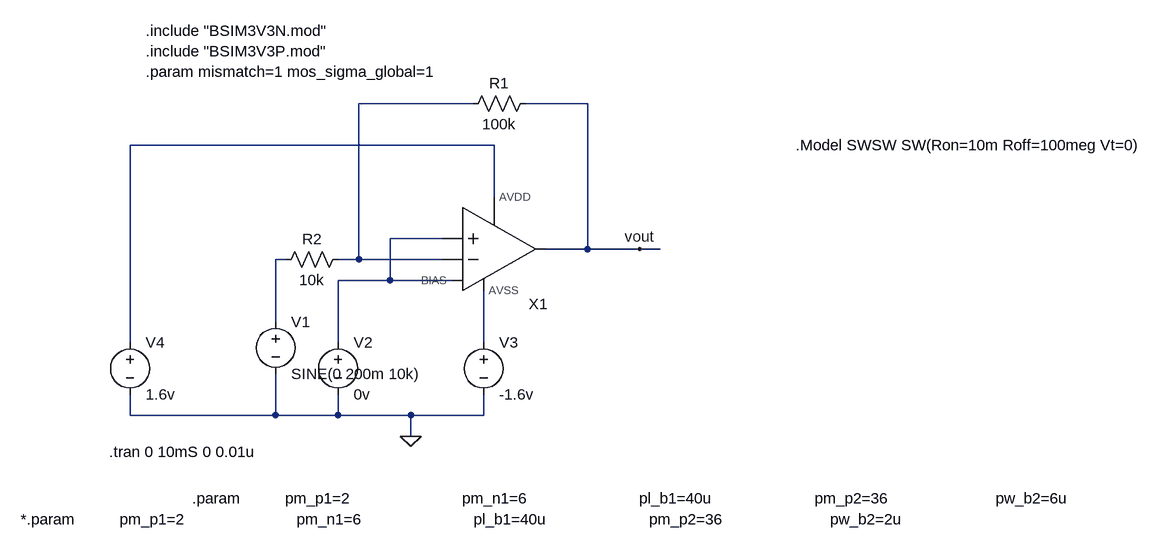
[diagram p0: schematic tb_comp_medium_trun.asc]
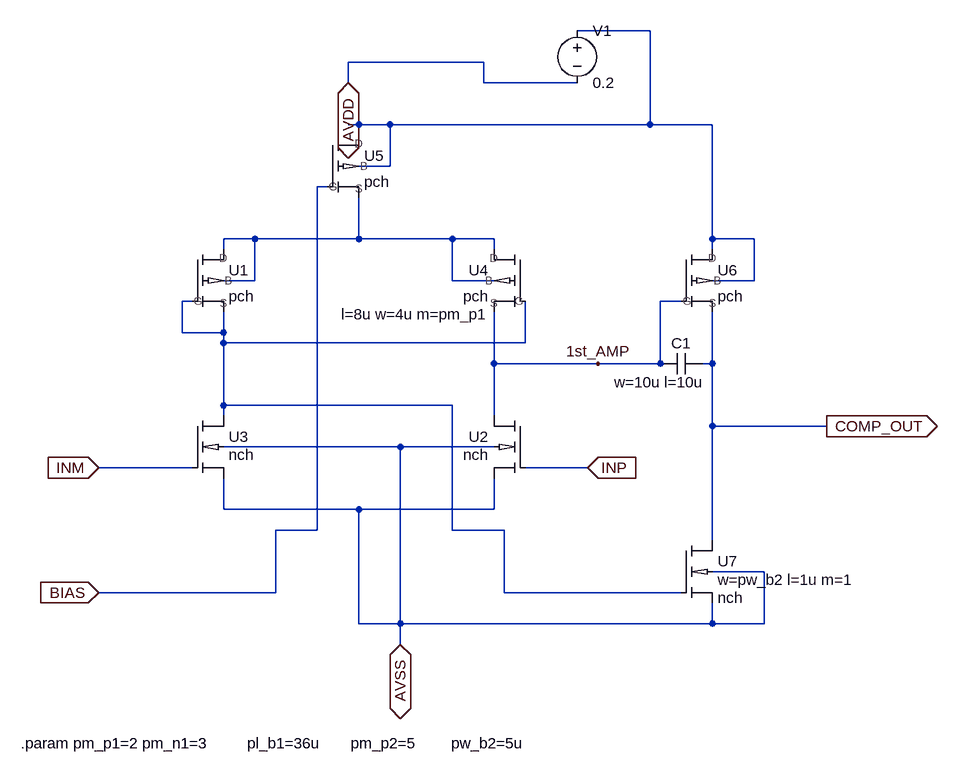
[diagram p1: sub-circuit comp_medium.asc]
tb_comp_medium_trun.asc, the LTspice schematic file:
Version 4
SHEET 1 1324 860
WIRE 192 -80 16 -80
WIRE 368 -80 272 -80
WIRE 224 -16 -336 -16
WIRE 224 64 224 -16
WIRE 144 128 64 128
WIRE 368 144 368 -80
WIRE 368 144 304 144
WIRE 448 144 368 144
WIRE 480 144 448 144
WIRE -96 160 -112 160
WIRE 16 160 16 -80
WIRE 16 160 -16 160
WIRE 144 160 16 160
WIRE 64 192 64 128
WIRE 64 192 -16 192
WIRE 160 192 64 192
WIRE -112 256 -112 160
WIRE -336 288 -336 -16
WIRE -16 288 -16 192
WIRE 208 288 208 208
WIRE -336 400 -336 368
WIRE -112 400 -112 336
WIRE -112 400 -336 400
WIRE -16 400 -16 368
WIRE -16 400 -112 400
WIRE 96 400 -16 400
WIRE 208 400 208 368
WIRE 208 400 96 400
WIRE 96 432 96 400
FLAG 96 432 0
FLAG 448 144 vout
SYMBOL comp_medium 208 144 R0
SYMATTR InstName X1
SYMBOL voltage -16 272 R0
WINDOW 123 0 0 Left 2
WINDOW 39 0 0 Left 2
SYMATTR InstName V2
SYMATTR Value 0v
SYMBOL voltage 208 272 R0
WINDOW 123 0 0 Left 2
WINDOW 39 0 0 Left 2
SYMATTR InstName V3
SYMATTR Value -1.6v
SYMBOL voltage -336 272 R0
WINDOW 123 0 0 Left 2
WINDOW 39 0 0 Left 2
SYMATTR InstName V4
SYMATTR Value 1.6v
SYMBOL voltage -112 240 R0
WINDOW 123 0 0 Left 2
WINDOW 39 0 0 Left 2
SYMATTR InstName V1
SYMATTR Value SINE(0 200m 10k)
SYMBOL res 176 -64 R270
WINDOW 0 32 56 VTop 2
WINDOW 3 0 56 VBottom 2
SYMATTR InstName R1
SYMATTR Value 100k
SYMBOL res -112 176 R270
WINDOW 0 32 56 VTop 2
WINDOW 3 0 56 VBottom 2
SYMATTR InstName R2
SYMATTR Value 10k
TEXT -368 456 Left 2 !.tran 0 10mS 0 0.01u
TEXT -504 560 Left 2 !*.param          pm_p1=2                         pm_n1=6                         pl_b1=40u                       pm_p2=36                        pw_b2=2u
TEXT 688 -16 Left 2 !.Model SWSW SW(Ron=10m Roff=100meg Vt=0)
TEXT -312 -192 Left 2 !.include "BSIM3V3N.mod"\n.include "BSIM3V3P.mod"\n.param mismatch=1 mos_sigma_global=1
TEXT -240 528 Left 2 !.param          pm_p1=2                         pm_n1=6                         pl_b1=40u                       pm_p2=36                        pw_b2=6u

comp_medium.asc, the sub-circuit schematic file:
Version 4
SHEET 1 3700 4048
WIRE 624 -256 512 -256
WIRE 368 -208 160 -208
WIRE 160 -176 160 -208
WIRE 368 -176 368 -208
WIRE 512 -176 368 -176
WIRE 176 -112 160 -112
WIRE 224 -112 176 -112
WIRE 624 -112 624 -256
WIRE 624 -112 224 -112
WIRE 720 -112 624 -112
WIRE 176 -96 176 -112
WIRE 224 -48 224 -112
WIRE 224 -48 176 -48
WIRE 128 -16 112 -16
WIRE 16 64 -32 64
WIRE 176 64 176 0
WIRE 176 64 16 64
WIRE 320 64 176 64
WIRE 384 64 320 64
WIRE 720 64 720 -112
WIRE 784 64 720 64
WIRE -32 80 -32 64
WIRE 384 80 384 64
WIRE 720 80 720 64
WIRE 16 128 16 64
WIRE 16 128 -32 128
WIRE 320 128 320 64
WIRE 384 128 320 128
WIRE 784 128 784 64
WIRE 784 128 720 128
WIRE -80 160 -96 160
WIRE 672 160 640 160
WIRE -96 208 -96 160
WIRE -32 208 -32 176
WIRE -32 208 -96 208
WIRE -32 224 -32 208
WIRE 432 224 432 160
WIRE 432 224 -32 224
WIRE 384 256 384 176
WIRE 544 256 384 256
WIRE 640 256 640 160
WIRE 640 256 544 256
WIRE 720 256 720 176
WIRE 720 256 704 256
WIRE -32 320 -32 224
WIRE 320 320 -32 320
WIRE -32 336 -32 320
WIRE 384 336 384 256
WIRE 720 352 720 256
WIRE 896 352 720 352
WIRE 240 384 -32 384
WIRE 384 384 240 384
WIRE -80 416 -224 416
WIRE 528 416 432 416
WIRE -32 480 -32 432
WIRE 176 480 -32 480
WIRE 384 480 384 432
WIRE 384 480 176 480
WIRE 112 512 112 -16
WIRE 112 512 48 512
WIRE 320 512 320 320
WIRE 400 512 320 512
WIRE 720 528 720 352
WIRE 800 576 720 576
WIRE 48 608 48 512
WIRE 48 608 -224 608
WIRE 400 608 400 512
WIRE 672 608 400 608
WIRE 176 656 176 480
WIRE 240 656 240 384
WIRE 240 656 176 656
WIRE 720 656 720 624
WIRE 720 656 240 656
WIRE 800 656 800 576
WIRE 800 656 720 656
WIRE 240 688 240 656
FLAG 160 -176 AVDD
IOPIN 160 -176 BiDir
FLAG 240 688 AVSS
IOPIN 240 688 BiDir
FLAG 528 416 INP
IOPIN 528 416 In
FLAG -224 416 INM
IOPIN -224 416 In
FLAG -224 608 BIAS
IOPIN -224 608 In
FLAG 896 352 COMP_OUT
IOPIN 896 352 Out
FLAG 544 256 1st_AMP
SYMBOL MPN -48 128 R0
WINDOW 39 24 52 Left 2
SYMATTR SpiceLine ""
SYMATTR InstName U1
SYMATTR Value pch
SYMATTR Prefix M
SYMATTR Value2 l=8u w=4u m=pm_p1
SYMBOL NMD4 432 336 M0
WINDOW 3 56 60 Left 2
WINDOW 38 56 88 Left 2
SYMATTR Value nch
SYMATTR InstName U2
SYMATTR Prefix M
SYMATTR Value2 l=16u w=1u m=pm_n1
SYMBOL NMD4 -80 336 R0
WINDOW 3 56 60 Left 2
WINDOW 38 56 88 Left 2
SYMATTR Value nch
SYMATTR InstName U3
SYMATTR Prefix M
SYMATTR Value2 l=16u w=1u m=pm_n1
SYMBOL MPN 400 128 M0
WINDOW 39 24 52 Left 2
SYMATTR SpiceLine l=8u w=4u m=pm_p1
SYMATTR InstName U4
SYMATTR Value pch
SYMATTR Prefix M
SYMBOL MPN 704 128 R0
WINDOW 39 24 52 Left 2
SYMATTR SpiceLine ""
SYMATTR InstName U6
SYMATTR Value pch
SYMATTR Prefix M
SYMATTR Value2 l=1u w=4u m=pm_p2
SYMBOL NMD4 672 528 R0
WINDOW 3 56 60 Left 2
WINDOW 38 56 88 Left 2
SYMATTR Value w=pw_b2 l=1u m=1
SYMATTR SpiceModel nch
SYMATTR InstName U7
SYMATTR Prefix M
SYMBOL cap 704 240 R90
WINDOW 0 0 32 VBottom 2
WINDOW 3 32 32 VTop 2
WINDOW 39 60 66 VBottom 2
SYMATTR InstName C1
SYMATTR Value ""
SYMATTR SpiceLine w=10u l=10u
SYMATTR Prefix X
SYMATTR SpiceModel CPIP
SYMBOL MPN 160 -48 R0
WINDOW 39 24 52 Left 2
SYMATTR SpiceLine ""
SYMATTR InstName U5
SYMATTR Value pch
SYMATTR Prefix M
SYMATTR Value2 l=2u w=pl_b1 m=1
SYMBOL voltage 512 -272 R0
WINDOW 123 0 0 Left 2
WINDOW 39 0 0 Left 2
SYMATTR InstName V1
SYMATTR Value 0.2
TEXT -344 840 Left 2 !.param pm_p1=2 pm_n1=3         pl_b1=36u       pm_p2=5        pw_b2=5u

The netlist it stands for:
* tb_comp_medium_trun.asc
XX1 N003 N003 N002 N005 vout N001 comp_medium
V2 N003 0 0v
V3 N005 0 -1.6v
V4 N002 0 1.6v
V1 N004 0 SINE(0 200m 10k)
R1 N001 vout 100k
R2 N004 N001 10k

* block symbol definitions
.subckt comp_medium BIAS INP AVDD AVSS COMP_OUT INM
M§U1 N002 N003 N003 N002 pch l=8u w=4u m=pm_p1
M§U2 1st_AMP INP AVSS AVSS nch l=16u w=1u m=pm_n1
M§U3 N003 INM AVSS AVSS nch l=16u w=1u m=pm_n1
M§U4 N002 N003 1st_AMP N002 pch l=8u w=4u m=pm_p1
M§U6 N001 1st_AMP COMP_OUT N001 pch l=1u w=4u m=pm_p2
M§U7 COMP_OUT N003 AVSS AVSS nch w=pw_b2 l=1u m=1
XC1 COMP_OUT 1st_AMP CPIP w=10u l=10u  ; pins A B
M§U5 N001 BIAS N002 N001 pch l=2u w=pl_b1 m=1
V1 N001 AVDD 0.2
.param pm_p1=2 pm_n1=3         pl_b1=36u       pm_p2=5        pw_b2=5u
.ends comp_medium

.model NMOS NMOS
.model PMOS PMOS
.lib standard.mos
.tran 0 10mS 0 0.01u
*.param          pm_p1=2                         pm_n1=6                         pl_b1=40u                       pm_p2=36                        pw_b2=2u
.Model SWSW SW(Ron=10m Roff=100meg Vt=0)
.include "BSIM3V3N.mod"
.include "BSIM3V3P.mod"
.param mismatch=1 mos_sigma_global=1
.param          pm_p1=2                         pm_n1=6                         pl_b1=40u                       pm_p2=36                        pw_b2=6u
.backanno
.end